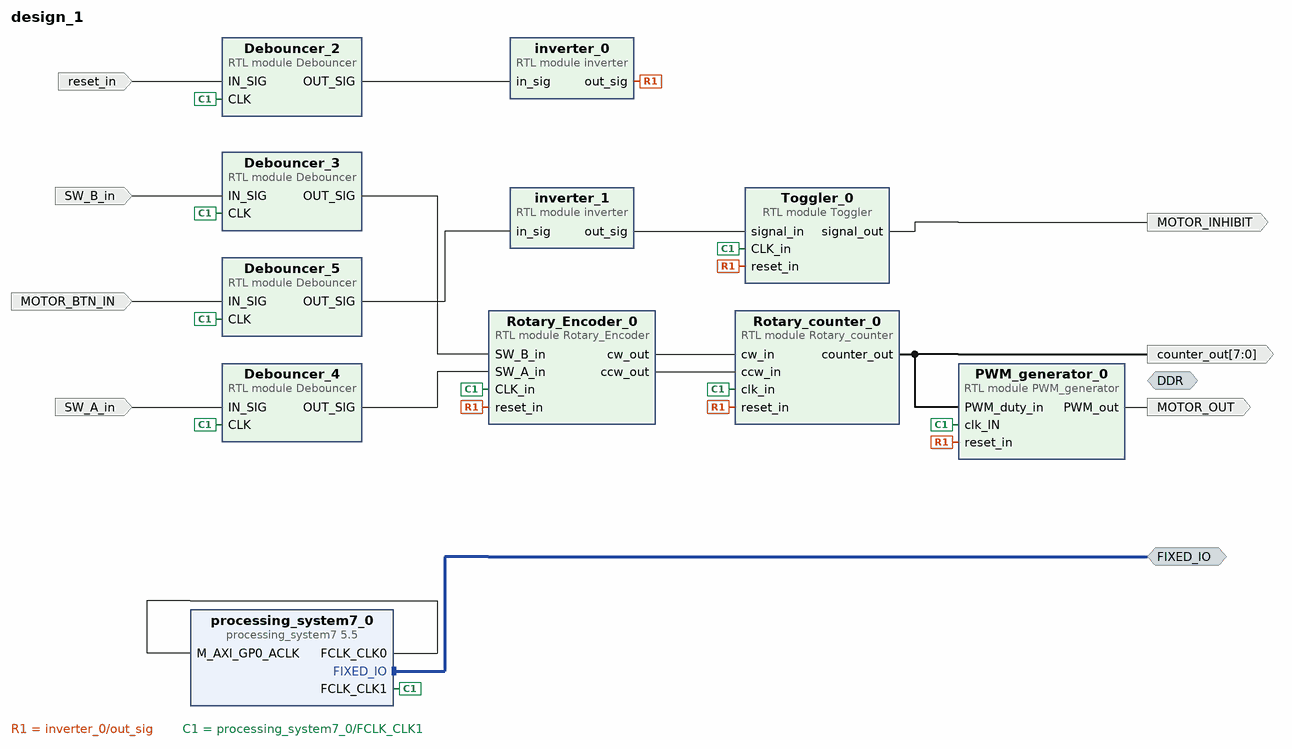
[diagram p0: block diagram of the top level]
# Vivado block design design_1, xc7z010clg225-1, Vivado 2016.3
create_bd_design design_1

create_bd_intf_port -mode Master -vlnv xilinx.com:display_processing_system7:fixedio_rtl:1.0 FIXED_IO
create_bd_intf_port -mode Master -vlnv xilinx.com:interface:ddrx_rtl:1.0 DDR
create_bd_port -dir I -type rst reset_in
set_property -dict {CONFIG.POLARITY ACTIVE_LOW} [get_bd_ports reset_in]
create_bd_port -dir I SW_B_in
create_bd_port -dir I SW_A_in
create_bd_port -dir I MOTOR_BTN_IN
create_bd_port -dir O MOTOR_OUT
create_bd_port -dir O MOTOR_INHIBIT
create_bd_port -dir O -from 7 -to 0 counter_out

create_bd_cell -type ip -vlnv xilinx.com:ip:processing_system7:5.5 processing_system7_0
set_property -dict [list \
  CONFIG.PCW_FCLK_CLK1_BUF TRUE \
  CONFIG.PCW_APU_PERIPHERAL_FREQMHZ 666.666666 \
  CONFIG.PCW_FPGA0_PERIPHERAL_FREQMHZ 50 \
  CONFIG.PCW_FPGA1_PERIPHERAL_FREQMHZ 200 \
  CONFIG.PCW_M_AXI_GP0_FREQMHZ 50 \
  CONFIG.PCW_NUM_F2P_INTR_INPUTS 1 \
  CONFIG.PCW_DQ_WIDTH 16 \
  CONFIG.PCW_DQS_WIDTH 2 \
  CONFIG.PCW_DM_WIDTH 2 \
  CONFIG.PCW_MIO_PRIMITIVE 32 \
  CONFIG.PCW_EN_CLK1_PORT 1 \
  CONFIG.PCW_PERIPHERAL_BOARD_PRESET part0 \
  CONFIG.PCW_PRESET_BANK1_VOLTAGE {LVCMOS 3.3V} \
  CONFIG.PCW_UIPARAM_DDR_ENABLE 0 \
  CONFIG.PCW_QSPI_PERIPHERAL_ENABLE 1 \
  CONFIG.PCW_QSPI_QSPI_IO {MIO 1 .. 6} \
  CONFIG.PCW_QSPI_GRP_SINGLE_SS_ENABLE 1 \
  CONFIG.PCW_QSPI_GRP_SINGLE_SS_IO {MIO 1 .. 6} \
  CONFIG.PCW_ENET0_PERIPHERAL_ENABLE 0 \
  CONFIG.PCW_SD0_PERIPHERAL_ENABLE 0 \
  CONFIG.PCW_UART1_PERIPHERAL_ENABLE 0 \
  CONFIG.PCW_USB0_PERIPHERAL_ENABLE 0 \
  CONFIG.PCW_USB_RESET_ENABLE 1 \
  CONFIG.PCW_I2C_RESET_ENABLE 1 \
  CONFIG.PCW_GPIO_MIO_GPIO_ENABLE 1 \
  CONFIG.PCW_GPIO_MIO_GPIO_IO MIO \
  CONFIG.PCW_APU_CLK_RATIO_ENABLE 0.251400462962963 \
  CONFIG.PCW_ENET0_PERIPHERAL_CLKSRC External \
  CONFIG.PCW_UIPARAM_GENERATE_SUMMARY NONE \
  CONFIG.PCW_FPGA_FCLK1_ENABLE 1 \
] [get_bd_cells processing_system7_0]
# 390 more settings of processing_system7_0 are not shown: defaults, MIO pin electricals, DDR timing, and values the tool derives
create_bd_cell -type module -reference Debouncer Debouncer_4
set_property -dict {CONFIG.THRESHOLD 100000} [get_bd_cells Debouncer_4]
create_bd_cell -type module -reference Rotary_counter Rotary_counter_0
create_bd_cell -type module -reference Rotary_Encoder Rotary_Encoder_0
create_bd_cell -type module -reference PWM_generator PWM_generator_0
create_bd_cell -type module -reference Debouncer Debouncer_2
set_property -dict {CONFIG.THRESHOLD 100000} [get_bd_cells Debouncer_2]
create_bd_cell -type module -reference Toggler Toggler_0
create_bd_cell -type module -reference inverter inverter_0
create_bd_cell -type module -reference inverter inverter_1
create_bd_cell -type module -reference Debouncer Debouncer_3
set_property -dict {CONFIG.THRESHOLD 1000} [get_bd_cells Debouncer_3]
create_bd_cell -type module -reference Debouncer Debouncer_5
set_property -dict {CONFIG.THRESHOLD 100000} [get_bd_cells Debouncer_5]

# ---- connections ----

connect_bd_intf_net [get_bd_intf_ports FIXED_IO] [get_bd_intf_pins processing_system7_0/FIXED_IO]
connect_bd_net [get_bd_pins processing_system7_0/FCLK_CLK0] [get_bd_pins processing_system7_0/M_AXI_GP0_ACLK]
connect_bd_net [get_bd_pins inverter_0/out_sig] \
  [get_bd_pins Rotary_counter_0/reset_in] [get_bd_pins Rotary_Encoder_0/reset_in] [get_bd_pins PWM_generator_0/reset_in] \
  [get_bd_pins Toggler_0/reset_in]
connect_bd_net [get_bd_pins Rotary_Encoder_0/cw_out] [get_bd_pins Rotary_counter_0/cw_in]
connect_bd_net [get_bd_pins Rotary_Encoder_0/ccw_out] [get_bd_pins Rotary_counter_0/ccw_in]
connect_bd_net [get_bd_pins processing_system7_0/FCLK_CLK1] \
  [get_bd_pins Debouncer_4/CLK] [get_bd_pins Rotary_counter_0/clk_in] [get_bd_pins Rotary_Encoder_0/CLK_in] \
  [get_bd_pins PWM_generator_0/clk_IN] [get_bd_pins Debouncer_2/CLK] [get_bd_pins Toggler_0/CLK_in] \
  [get_bd_pins Debouncer_3/CLK] [get_bd_pins Debouncer_5/CLK]
connect_bd_net [get_bd_ports reset_in] [get_bd_pins Debouncer_2/IN_SIG]
connect_bd_net [get_bd_pins Debouncer_2/OUT_SIG] [get_bd_pins inverter_0/in_sig]
connect_bd_net [get_bd_ports SW_B_in] [get_bd_pins Debouncer_3/IN_SIG]
connect_bd_net [get_bd_ports SW_A_in] [get_bd_pins Debouncer_4/IN_SIG]
connect_bd_net [get_bd_pins Debouncer_3/OUT_SIG] [get_bd_pins Rotary_Encoder_0/SW_B_in]
connect_bd_net [get_bd_pins Debouncer_4/OUT_SIG] [get_bd_pins Rotary_Encoder_0/SW_A_in]
connect_bd_net [get_bd_ports MOTOR_BTN_IN] [get_bd_pins Debouncer_5/IN_SIG]
connect_bd_net [get_bd_pins Debouncer_5/OUT_SIG] [get_bd_pins inverter_1/in_sig]
connect_bd_net [get_bd_pins inverter_1/out_sig] [get_bd_pins Toggler_0/signal_in]
connect_bd_net [get_bd_pins PWM_generator_0/PWM_out] [get_bd_ports MOTOR_OUT]
connect_bd_net [get_bd_pins Toggler_0/signal_out] [get_bd_ports MOTOR_INHIBIT]
connect_bd_net [get_bd_pins Rotary_counter_0/counter_out] [get_bd_ports counter_out] [get_bd_pins PWM_generator_0/PWM_duty_in]

validate_bd_design
save_bd_design
